# Altium schematic sheet Main.SchDoc
size A4; Date: 2.4.2023; Author: Wojciech Wołosz; Revision: 1; SheetNumber: 1; SheetTotal: 6; Version: 1.0
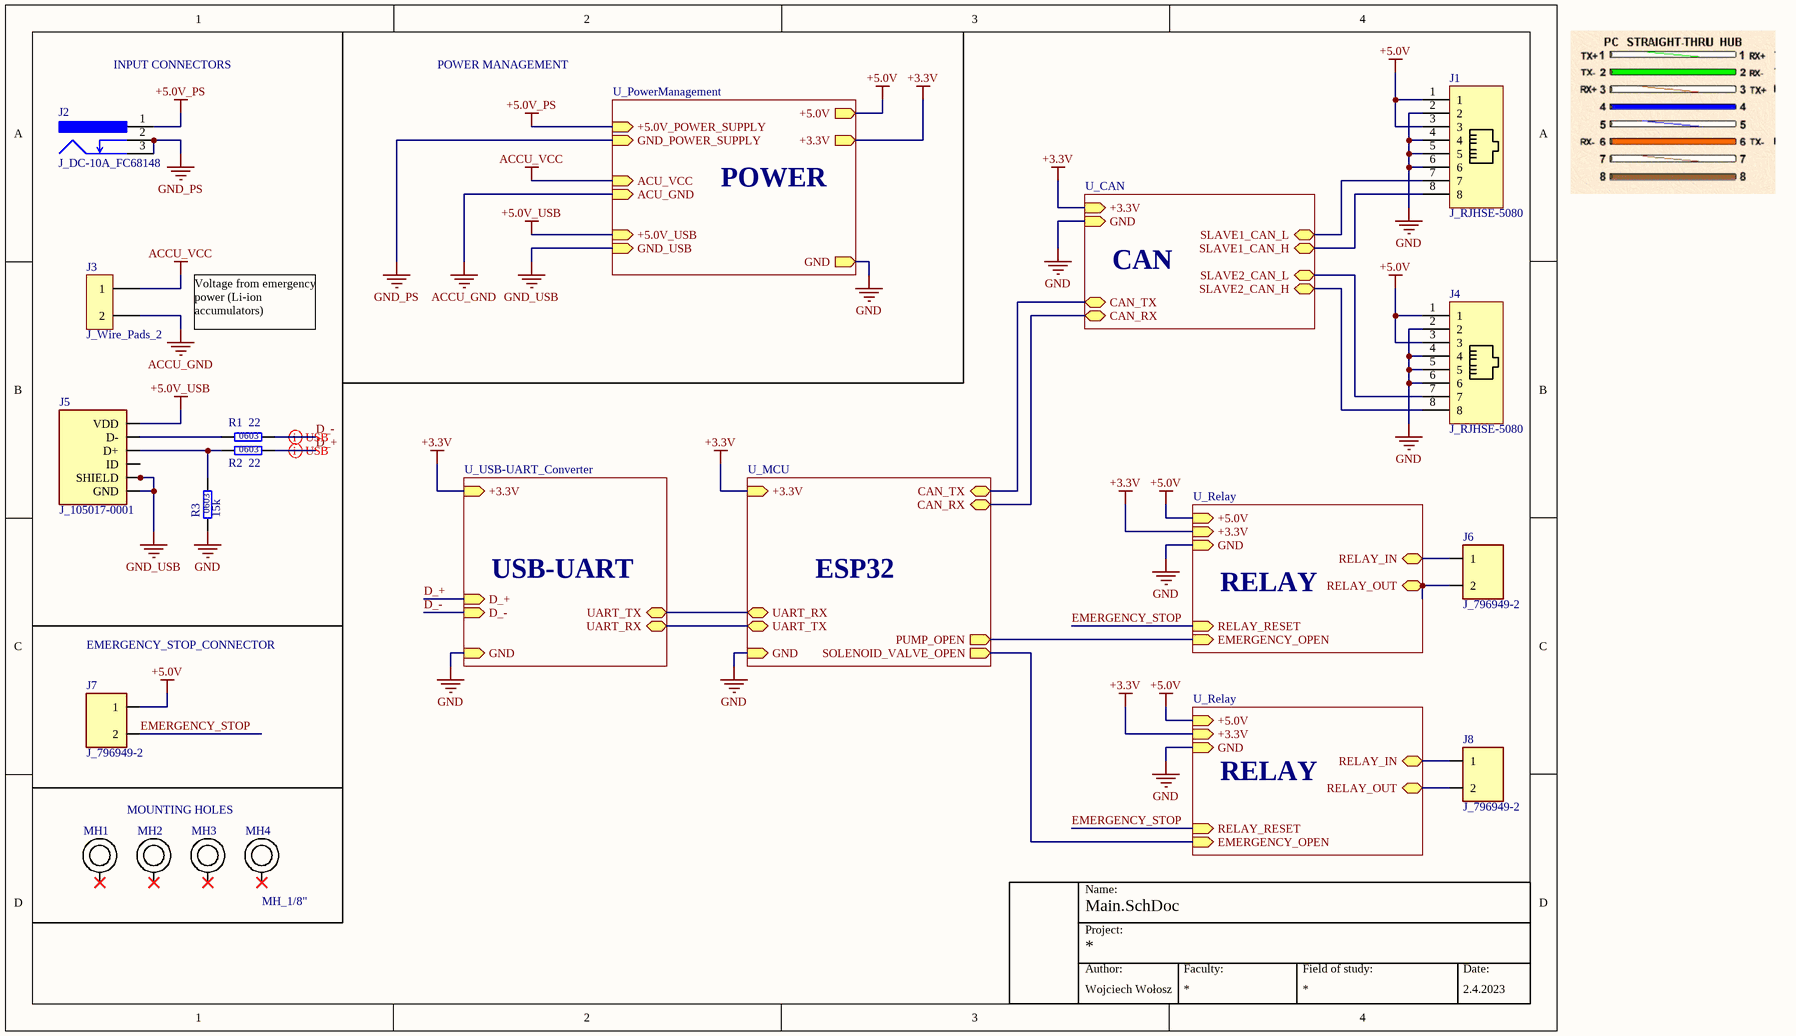
[diagram p0: Main.SchDoc]

## Parts
J1  J_RJHSE-5080  [J_RJHSE-5080]
J2  J_DC-10A_FC68148  [2_1x2_5_DC_CONN_THT]
J3  J_Wire_Pads_2  [J_Wire_Pads_2]
J4  J_RJHSE-5080  [J_RJHSE-5080]
J5  J_105017-0001  [MICROUSB_THT]
J6  J_796949-2  [TERMINAL_BLOCK_5.08_2POS]
J7  J_796949-2  [TERMINAL_BLOCK_5.08_2POS]
J8  J_796949-2  [TERMINAL_BLOCK_5.08_2POS]
MH1  MH_1/8"  [MH_1_8"]  (value not drawn)
MH2  MH_1/8"  [MH_1_8"]  (value not drawn)
MH3  MH_1/8"  [MH_1_8"]  (value not drawn)
MH4  MH_1/8"  [MH_1_8"]
R1  value 22  SCH_Footprint: 0603  [R_0603]  (hidden comment: R_22_0603_5)
R2  value 22  SCH_Footprint: 0603  [R_0603]  (hidden comment: R_22_0603_5)
R3  value 15k  SCH_Footprint: 0603  [R_0603]  (hidden comment: R_15k_0603_5)

## Sub-sheets
U_CAN = CAN.SchDoc: +3.3V (in), GND (in), CAN_TX (bidir), CAN_RX (bidir), SLAVE1_CAN_H (bidir), SLAVE1_CAN_L (bidir), SLAVE2_CAN_H (bidir), SLAVE2_CAN_L (bidir)
U_MCU = MCU.SchDoc: +3.3V (in), GND (in), CAN_TX (bidir), CAN_RX (bidir), UART_TX (bidir), UART_RX (bidir), PUMP_OPEN (out), SOLENOID_VALVE_OPEN (out)
U_PowerManagement = PowerManagement.SchDoc: +3.3V (out), +5.0V (out), GND (out), +5.0V_POWER_SUPPLY (in), +5.0V_USB (in), ACU_VCC (in), GND_POWER_SUPPLY (in), GND_USB (in), ACU_GND (in)
U_Relay = Relay.SchDoc: RELAY_IN (bidir), RELAY_OUT (bidir), GND (in), +5.0V (in), RELAY_RESET (in), EMERGENCY_OPEN (in), +3.3V (in)
U_Relay = Relay.SchDoc: RELAY_IN (bidir), RELAY_OUT (bidir), GND (in), +5.0V (in), RELAY_RESET (in), EMERGENCY_OPEN (in), +3.3V (in)
U_USB-UART_Converter = USB-UART_Converter.SchDoc: +3.3V (in), GND (in), D_+ (in), D_- (in), UART_TX (bidir), UART_RX (bidir)

## Nets
+3.3V: sheet U_Relay/+3.3V, sheet U_CAN/+3.3V, sheet U_PowerManagement/+3.3V, sheet U_MCU/+3.3V, sheet U_USB-UART_Converter/+3.3V, sheet U_Relay/+3.3V
+5.0V: J1.1 J1.3 J4.1 J4.3 J7.1 ; sheet U_Relay/+5.0V, sheet U_PowerManagement/+5.0V, sheet U_Relay/+5.0V
+5.0V_PS: J2.1 ; sheet U_PowerManagement/+5.0V_POWER_SUPPLY
+5.0V_USB: J5.1(VDD) ; sheet U_PowerManagement/+5.0V_USB
ACCU_GND: J3.2 ; sheet U_PowerManagement/ACU_GND
ACCU_VCC: J3.1(1) ; sheet U_PowerManagement/ACU_VCC
GND: J1.2 J1.4 J1.5 J1.6 J4.2 J4.4 J4.5 J4.6 R3.1 ; sheet U_Relay/GND, sheet U_CAN/GND, sheet U_PowerManagement/GND, sheet U_MCU/GND, sheet U_USB-UART_Converter/GND, sheet U_Relay/GND
GND_PS: J2.2 J2.3 ; sheet U_PowerManagement/GND_POWER_SUPPLY
GND_USB: J5.5(GND) J5.P$8(SHIELD) J5.P$9(SHIELD) J5.P$10(SHIELD) J5.P$11(SHIELD) ; sheet U_PowerManagement/GND_USB
D_+: R2.2 ; sheet U_USB-UART_Converter/D_+
D_-: R1.2 ; sheet U_USB-UART_Converter/D_-
EMERGENCY_STOP: J7.2 ; sheet U_Relay/RELAY_RESET, sheet U_Relay/RELAY_RESET
NetJ1_7: J1.7 ; sheet U_CAN/SLAVE1_CAN_L
NetJ1_8: J1.8 ; sheet U_CAN/SLAVE1_CAN_H
NetJ4_7: J4.7 ; sheet U_CAN/SLAVE2_CAN_L
NetJ4_8: J4.8 ; sheet U_CAN/SLAVE2_CAN_H
NetJ5_2: J5.2(D-) R1.1
NetJ5_3: J5.3(D+) R2.1 R3.2
NetJ6_1: J6.1 ; sheet U_Relay/RELAY_IN
NetJ6_2: J6.2 ; sheet U_Relay/RELAY_OUT
NetJ8_1: J8.1 ; sheet U_Relay/RELAY_IN
NetJ8_2: J8.2 ; sheet U_Relay/RELAY_OUT
(unnamed): sheet U_Relay/EMERGENCY_OPEN, sheet U_MCU/SOLENOID_VALVE_OPEN
(unnamed): sheet U_CAN/CAN_TX, sheet U_MCU/CAN_TX
(unnamed): sheet U_CAN/CAN_RX, sheet U_MCU/CAN_RX
(unnamed): sheet U_MCU/UART_TX, sheet U_USB-UART_Converter/UART_RX
(unnamed): sheet U_MCU/UART_RX, sheet U_USB-UART_Converter/UART_TX
(unnamed): sheet U_MCU/PUMP_OPEN, sheet U_Relay/EMERGENCY_OPEN

Not connected (* = marked no-connect by the designer): J5 4(ID); MH1 1*; MH2 1*; MH3 1*; MH4 1*

## Layout directives
differential pair: D_+, D_-

## Notes on the sheet
- INPUT CONNECTORS
- POWER MANAGEMENT
- POWER
- CAN
- Voltage from emergency power (Li-ion accumulators)
- USB-UART
- ESP32
- EMERGENCY_STOP_CONNECTOR
- RELAY
- MOUNTING HOLES
- Name:
- Project:
- Author:
- Faculty:
- Field of study:
- Date:

## Library data of the parts
J1 J4 = CMP-002-00029-5: RJ-45; Jack Modular Connector 8p8c (RJ45, Ethernet) 90° Angle (Right) Unshielded; Connector Type: RJ45; Pins: 8; Case/Package: THT
J2 = CMP-002-00026-5: Socket; DC supply; male; 5.5/2.1mm; 5.5mm; 2.1mm; soldering; 5A THT; Manuf. Part: DC-10A FC68148; Voltage Rating: 12V; Max Current Rating: 5A; RoHS Compliant: Yes; SCH_Footprint: 2_1x2_5_DC_CONN_THT; Mounting Technology: THT; Case/Package: -; ComponentLink1URL: https://www.tme.eu/Document/9908a311fa187cab41d52074eae7ada8/FC68148.pdf; Gender: Male; ComponentLink1Description: Datasheet; Pins: 3; Connector Type: DC Supply
J3 = CMP-002-00010-5: Pads used for soldering wires / measurement,; SCH_Footprint: WIREPAD_2
J5 = CMP-00027-00001-7: USB Connectors MICRO USB B RECPT BTTM MNT SMT TH TABS; Max Current Rating: 1A; Voltage Rating: 30V; Connector Type: Signal; Gender: Female; Orientation: Right Angle; Min Operating Temperature: -30°C; Mounting Technology: THT; SCH_Footprint: MICROUSB_THT; Max Operating Temperature: 85°C; Case/Package: -; Pins: 5; ComponentLink1Description: Datasheet; ComponentLink1URL: https://www.molex.com/molex/products/part-detail/io_connectors/1050170001; RoHS Compliant: Yes
J6-J8 = CMP-002-00027-3: Fixed Terminal Blocks 5.08MM VERTICAL 2P wire protector; Wire Gauge Max: 12 AWG; Max Current Rating: 17.5A; Wire Gauge Min: 30 AWG; Voltage Rating: 300V; RoHS Compliant: Yes; Pins: 2; Pitch: 5.08mm; Connector Type: Terminal Block; Case/Package: -; Mounting Technology: THT; Gender: -
MH1-MH4 = CMP-002-000009-2: 1/8"/0.22" (3.2mm x 5.5mm) Mounting hole; Hole size [inch]: 1\8"; Hole size [mm]: 3.2mm; Diameter [mm]: 5.5mm; Diameter [inch]: 0.22"
R1 R2 = CMP-009-00037-4: Tolerance: 5%; Pins: 2
R3 = CMP-009-00036-4: Thick Film Resistors - SMD 1/10watt 15Kohms 5%; Pins: 2; HelpURL: https://eu.mouser.com/datasheet/2/427/dcrcwe3-1762152.pdf; Case/Package: 0603; Tolerance: 5%